# Altium project ACEcar.PrjPcb
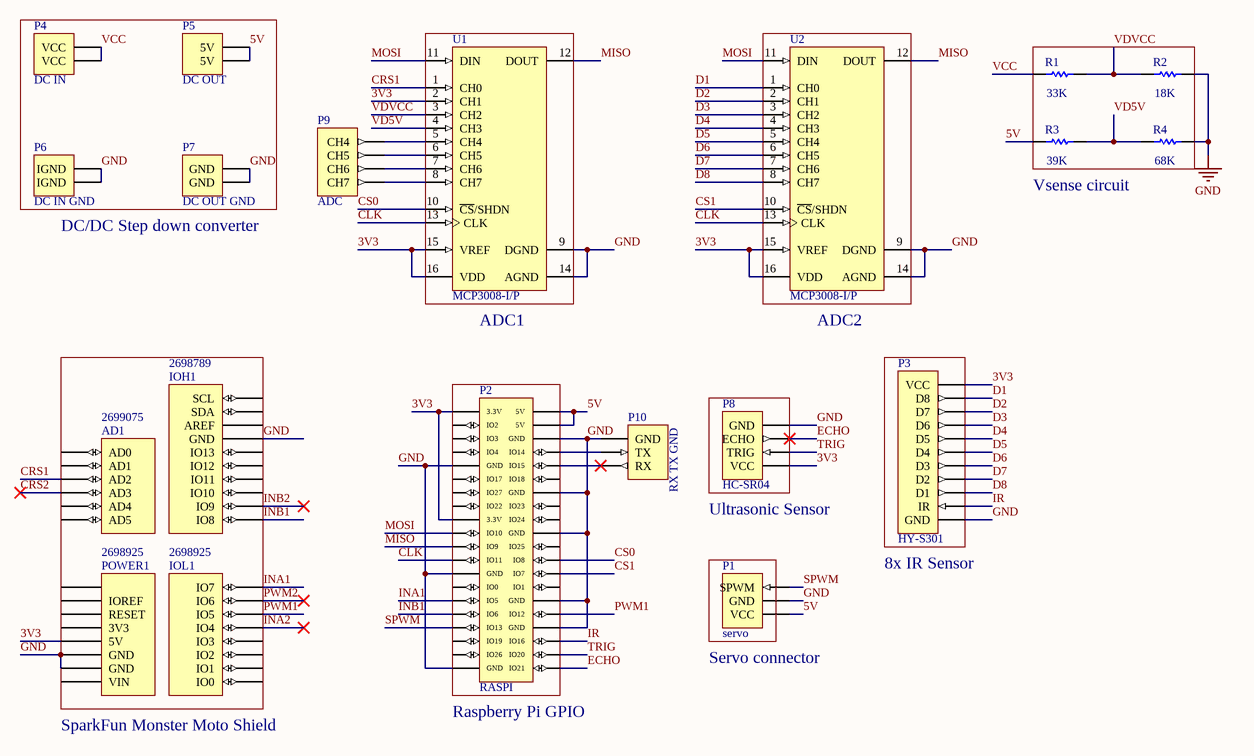
[diagram p0: Sheet1.SchDoc]
1 sheet, 20 parts. Net scope: global (net labels, ports and power ports of the same name join across sheets).
Board file: PCB1.PcbDoc

## Sheet Sheet1.SchDoc
size A4; SheetNumber: 1; SheetTotal: 1; SPICEModelCacheJYXXUXRF: <root> / <DocumentId>JYXXUXRF</DocumentId> / </root>

### Parts
AD1  Supplier Part Number 4: 2699075  [Header 6x1 8.5mm]  (hidden comment: AD)
IOH1  Supplier Part Number 3: 2698789  [Header 10x1 8.5mm]  (hidden comment: IOH)
IOL1  Supplier Part Number 4: 2698925  [Header 8x1 8.5mm]  (hidden comment: IOL)
P1  servo  [HDR1X3]
P2  RASPI  [HDR2X20]
P3  HY-S301  [HDR1X11]
P4  DC IN  [HDR1X2]
P5  DC OUT  [HDR1X2]
P6  DC IN GND  [HDR1X2]
P7  DC OUT GND  [HDR1X2]
P8  HC-SR04  [HDR1X4]
P9  ADC  [HDR1X4]
P10  RX TX GND  [HDR1X3]
POWER1  Supplier Part Number 4: 2698925  [Header 8x1 8.5mm]  (hidden comment: POWER_UNO)
R1  33K  [RESC3216X70X50LL05T20]
R2  18K  [RESC3216X70X50LL05T20]
R3  39K  [RESC3216X70X50LL05T20]
R4  68K  [RESC3216X70X50LL05T20]
U1  MCP3008-I/P  [PDIP300-P16]
U2  MCP3008-I/P  [PDIP300-P16]

### Nets
GND: IOH1.7(GND) P1.2(GND) P2.6(GND) P2.9(GND) P2.14(GND) P2.20(GND) P2.25(GND) P2.30(GND) P2.34(GND) P2.39(GND) P3.1(GND) P6.1(IGND) P6.2(IGND) P7.1(GND) P7.2(GND) P8.4(GND) P10.1(GND) POWER1.2(GND) POWER1.3(GND) R2.2 R4.2 U1.9(DGND) U1.14(AGND) U2.9(DGND) U2.14(AGND)
3V3: P2.1(3.3V) P2.17(3.3V) P3.11(VCC) P8.1(VCC) POWER1.4(5V) U1.2(CH1) U1.15(VREF) U1.16(VDD) U2.15(VREF) U2.16(VDD)
5V: P1.1(VCC) P2.2(5V) P2.4(5V) P5.1(5V) P5.2(5V) R3.1
CLK: P2.23(IO11) U1.13(CLK) U2.13(CLK)
CRS1: AD1.3(AD2) U1.1(CH0)
CRS2: AD1.4(AD3)
CS0: P2.24(IO8) U1.10(~{CS}/SHDN)
CS1: P2.26(IO7) U2.10(~{CS}/SHDN)
D1: P3.10(D8) U2.1(CH0)
D2: P3.9(D7) U2.2(CH1)
D3: P3.8(D6) U2.3(CH2)
D4: P3.7(D5) U2.4(CH3)
D5: P3.6(D4) U2.5(CH4)
D6: P3.5(D3) U2.6(CH5)
D7: P3.4(D2) U2.7(CH6)
D8: P3.3(D1) U2.8(CH7)
ECHO: P2.40(IO21) P8.3(ECHO)
INA1: IOL1.8(IO7) P2.29(IO5)
INA2: IOL1.5(IO4)
INB1: IOH1.1(IO8) P2.31(IO6)
INB2: IOH1.2(IO9)
IR: P2.36(IO16) P3.2(IR)
MISO: P2.21(IO9) U1.12(DOUT) U2.12(DOUT)
MOSI: P2.19(IO10) U1.11(DIN) U2.11(DIN)
PWM1: IOL1.6(IO5) P2.32(IO12)
PWM2: IOL1.7(IO6)
SPWM: P1.3(SPWM) P2.33(IO13)
TRIG: P2.38(IO20) P8.2(TRIG)
VCC: P4.1(VCC) P4.2(VCC) R1.1
VD5V: R3.2 R4.1 U1.4(CH3)
VDVCC: R1.2 R2.1 U1.3(CH2)
NetP2_8: P2.8(IO14) P10.2(TX)
NetP2_10: P2.10(IO15) P10.3(RX)
NetP9_1: P9.1(CH7) U1.8(CH7)
NetP9_2: P9.2(CH6) U1.7(CH6)
NetP9_3: P9.3(CH5) U1.6(CH5)
NetP9_4: P9.4(CH4) U1.5(CH4)

Not connected (* = marked no-connect by the designer): AD1 1(AD0) 2(AD1) 5(AD4) 6(AD5); IOH1 3(IO10) 4(IO11) 5(IO12) 6(IO13) 8(AREF) 9(SDA) 10(SCL); IOL1 1(IO0) 2(IO1) 3(IO2) 4(IO3); P2 3(IO2) 5(IO3) 7(IO4) 11(IO17) 12(IO18) 13(IO27) 15(IO22) 16(IO23) 18(IO24) 22(IO25) 27(IO0) 28(IO1) 35(IO19) 37(IO26); POWER1 1(VIN) 5(3V3) 6(RESET) 7(IOREF) 8

### Notes on the sheet
- DC/DC Step down converter
- Vsense circuit
- (near U1) ADC1
- (near U2) ADC2
- (near P8) Ultrasonic Sensor
- (near P3) 8x IR Sensor
- (near P2) Raspberry Pi GPIO
- (near P1) Servo connector
- SparkFun Monster Moto Shield

### Library data of the parts
P1 P10 = Header 3: Header, 3-Pin; LatestRevisionDate: 17-Jul-2002; LatestRevisionNote: Re-released for DXP Platform.; Publisher: Altium Limited
P2 = Header 20X2: Header, 20-Pin, Dual row; LatestRevisionDate: 17-Jul-2002; LatestRevisionNote: Re-released for DXP Platform.; Publisher: Altium Limited
P3 = Header 11: Header, 11-Pin; LatestRevisionDate: 17-Jul-2002; LatestRevisionNote: Re-released for DXP Platform.; Publisher: Altium Limited
P4-P7 = Header 2: Header, 2-Pin; LatestRevisionDate: 17-Jul-2002; LatestRevisionNote: Re-released for DXP Platform.; Publisher: Altium Limited
P8 P9 = Header 4: Header, 4-Pin; LatestRevisionDate: 17-Jul-2002; LatestRevisionNote: Re-released for DXP Platform.; Publisher: Altium Limited
R1 = CMP-2003-00019-1: 100K; Manufacturer: Panasonic; Part Number: ERJ-8ENF1003V
R2 R4 = CMP-2003-00835-1: Manufacturer: Panasonic; Part Number: ERJ8ENF3302V
R3 = CMP-2003-00571-1: Manufacturer: Panasonic; Part Number: ERJ-8GEYJ183V
U1 U2 = CMP-0188-00184-2: 2.7V 4-Channel/8-Channel 10-Bit A/D Converters with SPI Serial Interface, 16-Pin PDIP, Industrial Temperature; ComponentLink1URL: http://www.microchip.com/; ComponentLink2URL: http://ww1.microchip.com/downloads/en/DeviceDoc/21295d.pdf; PackageVersion: revBB, Aug-2009; ComponentLink3URL: http://www.microchip.com/stellent/groups/techpub_sg/documents/packagingspec/en012702.pdf; DatasheetVersion: revD, Dec-2008; PackageDescription: 16-Lead Plastic Dual In-Line (P) - 300 mil Body [PDIP]; ComponentLink3Description: Package Specification; Code_JEDEC: MS-001-BB; ComponentLink1Description: Manufacturer URL; RevisionNote: URLs added.; PackageReference: PDIP300-P16; ComponentLink2Description: Datasheet
AD1 = AD: Supplier 1: Arrow; Supplier Part Number 1: 2699089; Supplier 2: Digi-Key; Supplier Part Number 2: SAM1198-06-ND; Supplier 3: Arrow; Supplier Part Number 3: 2699088; Supplier 4: Arrow
IOH1 = IOH: Supplier 1: Arrow; Supplier Part Number 1: 2698803S4475693N1004; Supplier 2: Digi-Key; Supplier Part Number 2: SAM1198-10-ND; Supplier 3: Arrow
IOL1 = IOL: Supplier 1: Digi-Key; Supplier Part Number 1: SAM1198-08-ND; Supplier 2: Arrow; Supplier Part Number 2: 2698939; Supplier 3: Arrow; Supplier Part Number 3: 2698940; Supplier 4: Arrow
POWER1 = POWER_UNO: Supplier 1: Digi-Key; Supplier Part Number 1: SAM1198-08-ND; Supplier 2: Arrow; Supplier Part Number 2: 2698939; Supplier 3: Arrow; Supplier Part Number 3: 2698940; Supplier 4: Arrow